# Altium project 452007098_MVEPP主传感器板.PrjPcb
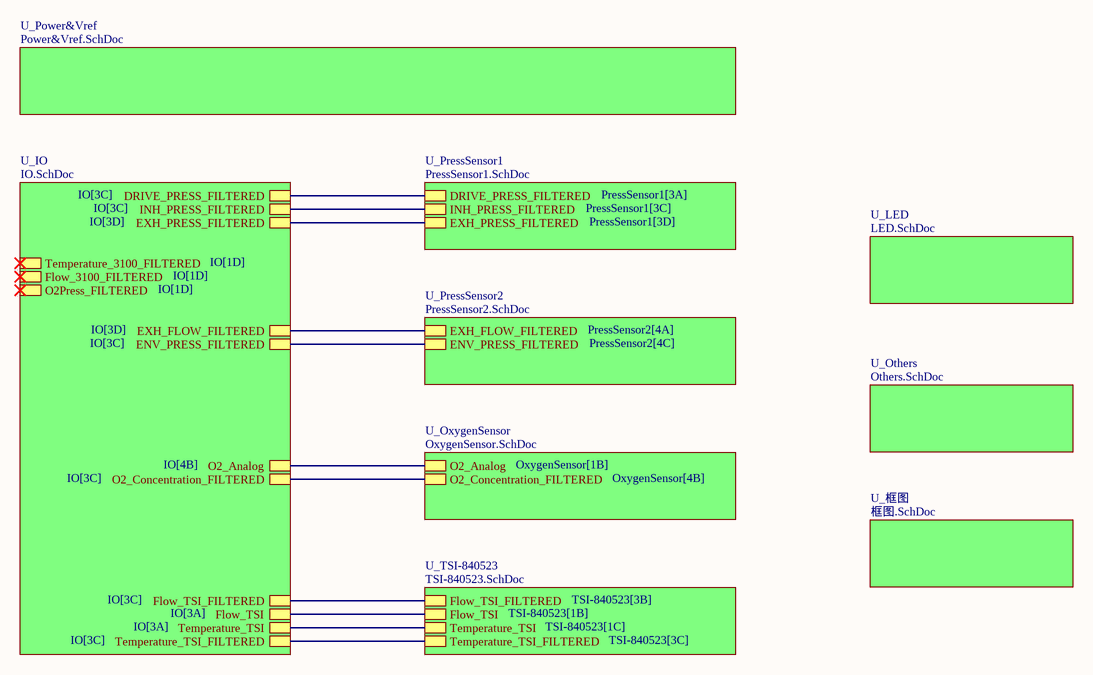
[diagram p0: Top.SchDoc]
10 sheets, 206 parts. Net scope: hierarchical (ports join the sheet entries above them; power ports are global).
Board file: PCB.PcbDoc
Sheets:
  Top.SchDoc
    U_OxygenSensor = OxygenSensor.SchDoc
    U_PressSensor1 = PressSensor1.SchDoc
    U_PressSensor2 = PressSensor2.SchDoc
    U_TSI-840523 = TSI-840523.SchDoc
    U_IO = IO.SchDoc
    U_Power&Vref = Power&Vref.SchDoc
    U_Others = Others.SchDoc
    U_框图 = 框图.SchDoc
    U_LED = LED.SchDoc

## Sheet Top.SchDoc
size A4; SheetNumber: 1; SheetTotal: 10

### Sub-sheets
U_IO = IO.SchDoc: O2_Concentration_FILTERED, Flow_TSI_FILTERED, Flow_TSI, Temperature_TSI, Temperature_TSI_FILTERED, DRIVE_PRESS_FILTERED, INH_PRESS_FILTERED, EXH_PRESS_FILTERED, EXH_FLOW_FILTERED, ENV_PRESS_FILTERED, O2_Analog, Temperature_3100_FILTERED, Flow_3100_FILTERED, O2Press_FILTERED
U_LED = LED.SchDoc: no entries
U_Others = Others.SchDoc: no entries
U_OxygenSensor = OxygenSensor.SchDoc: O2_Analog, O2_Concentration_FILTERED
U_Power&Vref = Power&Vref.SchDoc: no entries
U_PressSensor1 = PressSensor1.SchDoc: DRIVE_PRESS_FILTERED, INH_PRESS_FILTERED, EXH_PRESS_FILTERED
U_PressSensor2 = PressSensor2.SchDoc: EXH_FLOW_FILTERED, ENV_PRESS_FILTERED
U_TSI-840523 = TSI-840523.SchDoc: Flow_TSI_FILTERED, Flow_TSI, Temperature_TSI, Temperature_TSI_FILTERED
U_框图 = 框图.SchDoc: no entries

### Nets
DRIVE_PRESS_FILTERED: sheet U_PressSensor1/DRIVE_PRESS_FILTERED, sheet U_IO/DRIVE_PRESS_FILTERED
ENV_PRESS_FILTERED: sheet U_PressSensor2/ENV_PRESS_FILTERED, sheet U_IO/ENV_PRESS_FILTERED
EXH_FLOW_FILTERED: sheet U_PressSensor2/EXH_FLOW_FILTERED, sheet U_IO/EXH_FLOW_FILTERED
EXH_PRESS_FILTERED: sheet U_PressSensor1/EXH_PRESS_FILTERED, sheet U_IO/EXH_PRESS_FILTERED
Flow_TSI: sheet U_TSI-840523/Flow_TSI, sheet U_IO/Flow_TSI
Flow_TSI_FILTERED: sheet U_TSI-840523/Flow_TSI_FILTERED, sheet U_IO/Flow_TSI_FILTERED
INH_PRESS_FILTERED: sheet U_PressSensor1/INH_PRESS_FILTERED, sheet U_IO/INH_PRESS_FILTERED
O2_Analog: sheet U_OxygenSensor/O2_Analog, sheet U_IO/O2_Analog
O2_Concentration_FILTERED: sheet U_OxygenSensor/O2_Concentration_FILTERED, sheet U_IO/O2_Concentration_FILTERED
Temperature_TSI: sheet U_TSI-840523/Temperature_TSI, sheet U_IO/Temperature_TSI
Temperature_TSI_FILTERED: sheet U_TSI-840523/Temperature_TSI_FILTERED, sheet U_IO/Temperature_TSI_FILTERED

## Sheet OxygenSensor.SchDoc
size A4; SheetNumber: 5; SheetTotal: 10
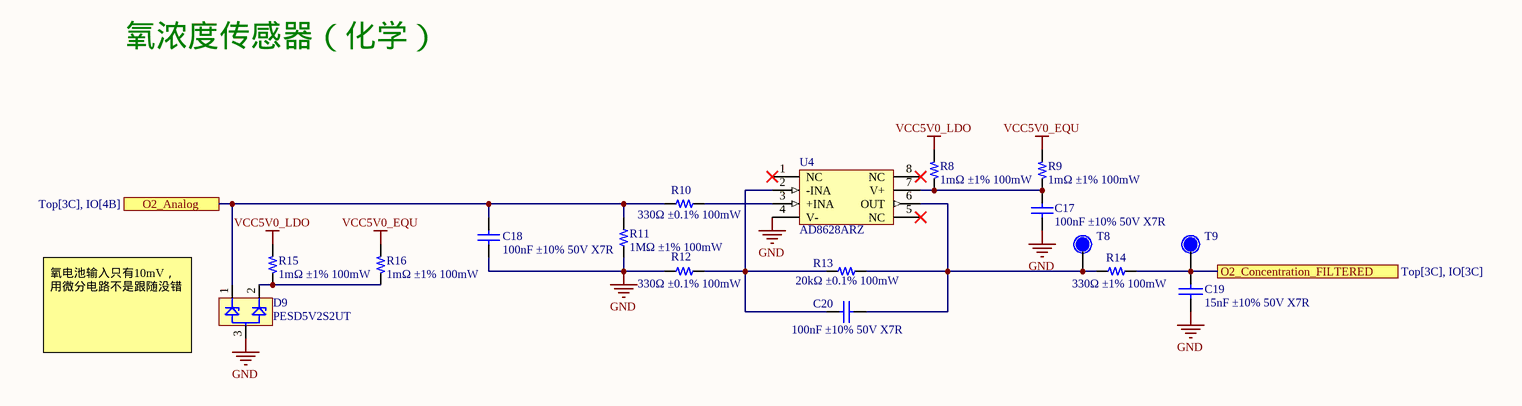
[diagram p1: OxygenSensor.SchDoc]

### Parts
C17  100nF ±10% 50V X7R  [C-0603]
C18  100nF ±10% 50V X7R  [C-0603]
C19  15nF ±10% 50V X7R  [C-0603]
C20  100nF ±10% 50V X7R  [C-0603]
D9  PESD5V2S2UT  [sot23-3]
R8  1mΩ ±1% 100mW  [R-0603]
R9  1mΩ ±1% 100mW  [R-0603]
R10  330Ω ±0.1% 100mW  [R-0603]
R11  1MΩ ±1% 100mW  [R-0603]
R12  330Ω ±0.1% 100mW  [R-0603]
R13  20kΩ ±0.1% 100mW  [R-0603]
R14  330Ω ±1% 100mW  [R-0603]
R15  1mΩ ±1% 100mW  [R-0603]
R16  1mΩ ±1% 100mW  [R-0603]
T8  Test?  [TestPad_SMD]  (value not drawn)
T9  Test?  [TestPad_SMD]  (value not drawn)
U4  AD8628ARZ  [SOIC8]

### Ports
O2_Analog (see Top[3C], IO[4B]), O2_Concentration_FILTERED (see Top[3C], IO[3C])

### Nets
GND: C17.2 C18.1 C19.1 D9.3 R11.2 R12.1(TOP) U4.4(V-)
VCC5V0_EQU: R9.2(BOT) R16.2(BOT)
VCC5V0_LDO: R8.2(BOT) R15.2(BOT)
O2_Analog: C18.2 D9.1 R10.1(TOP) R11.1 ; port O2_Analog
O2_Concentration_FILTERED: C19.2 R14.1 T9.1 ; port O2_Concentration_FILTERED
NetC17_1: C17.1 R8.1(TOP) R9.1(TOP) U4.7(V+)
NetC20_1: C20.1 R12.2(BOT) R13.1(TOP) U4.2(-INA)
NetC20_2: C20.2 R13.2(BOT) R14.2 T8.1 U4.6(OUT)
NetD9_2: D9.2 R15.1(TOP) R16.1(TOP)
NetR10_2: R10.2(BOT) U4.3(+INA)

Not connected (* = marked no-connect by the designer): U4 1(NC)* 5(NC)* 8(NC)*

### Notes on the sheet
- 氧浓度传感器（化学）
- (near D9) 氧电池输入只有10mV，用微分电路不是跟随没错

### Library data of the parts
C17 C18 C20 = 100nF_1: 物料编号: 210001894; 详细描述: X7R,50V,三星CL21B104JBCNNNC; 版本: V1.00; 名称: 贴片瓷介电容100nF±5%,0805; 制造商: 三星
C19 = CAP: Capacitor
D9 = PESDxS2UT
R8 R9 R15 R16 = 10K_1: 国巨 / 1mΩ ±1% 100mW; 版本: V1.00; 名称: 贴片电阻10K±1%; 物料编号: 210001830; 详细描述: 0805,1/8W,国巨RC0805FR-0710K; 制造商: 国巨
R10 R12 = 330Ω_1: 国巨RC0805FR-07330R; 物料编号: 210000706; 详细描述: 0805,1/8W,国巨RC0805FR-07330R; 制造商: 国巨; 版本: V1.00; 名称: 贴片电阻330±1%
R11 R14 = R-0603
R13 = 12K_1: 国巨RC0805FR-0712K; 物料编号: 210000764; 详细描述: 0805,1/8W,国巨RC0805FR-0712K; 制造商: 国巨; 版本: V1.00; 名称: 贴片电阻12K±1%
T8 T9 = TestPad_SMD
U4 = AD8628ARZ: 版本: V1.00; 名称: 芯片AD8628ARZ; 物料编号: 210001135; 详细描述: 精密运放AD8628ARZ ,SOIC8,-40℃+125℃; 制造商: ADI

## Sheet PressSensor1.SchDoc
size A4; SheetNumber: 7; SheetTotal: 10
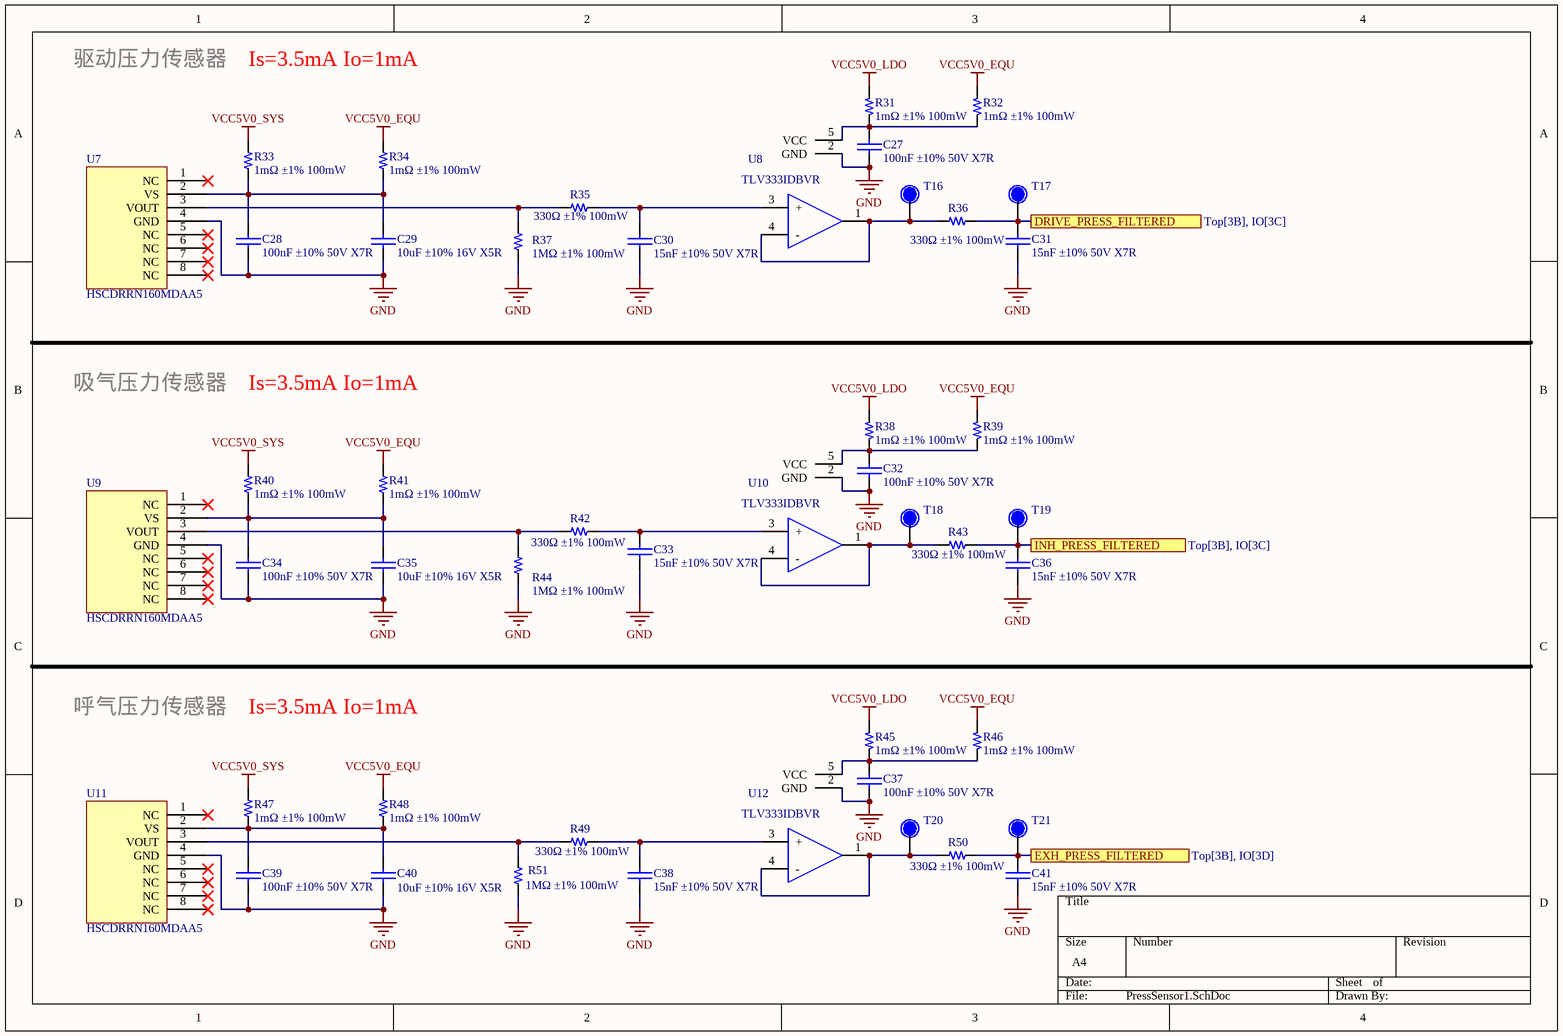
[diagram p2: PressSensor1.SchDoc]

### Parts
C27  100nF ±10% 50V X7R  [C-0603]
C28  100nF ±10% 50V X7R  [C-0603]
C29  10uF ±10% 16V X5R  [C-0805]
C30  15nF ±10% 50V X7R  [C-0603]
C31  15nF ±10% 50V X7R  [C-0603]
C32  100nF ±10% 50V X7R  [C-0603]
C33  15nF ±10% 50V X7R  [C-0603]
C34  100nF ±10% 50V X7R  [C-0603]
C35  10uF ±10% 16V X5R  [C-0805]
C36  15nF ±10% 50V X7R  [C-0603]
C37  100nF ±10% 50V X7R  [C-0603]
C38  15nF ±10% 50V X7R  [C-0603]
C39  100nF ±10% 50V X7R  [C-0603]
C40  10uF ±10% 16V X5R  [C-0805]
C41  15nF ±10% 50V X7R  [C-0603]
R31  1mΩ ±1% 100mW  [R-0603]
R32  1mΩ ±1% 100mW  [R-0603]
R33  1mΩ ±1% 100mW  [R-0603]
R34  1mΩ ±1% 100mW  [R-0603]
R35  330Ω ±1% 100mW  [R-0603]
R36  330Ω ±1% 100mW  [R-0603]
R37  1MΩ ±1% 100mW  [R-0603]
R38  1mΩ ±1% 100mW  [R-0603]
R39  1mΩ ±1% 100mW  [R-0603]
R40  1mΩ ±1% 100mW  [R-0603]
R41  1mΩ ±1% 100mW  [R-0603]
R42  330Ω ±1% 100mW  [R-0603]
R43  330Ω ±1% 100mW  [R-0603]
R44  1MΩ ±1% 100mW  [R-0603]
R45  1mΩ ±1% 100mW  [R-0603]
R46  1mΩ ±1% 100mW  [R-0603]
R47  1mΩ ±1% 100mW  [R-0603]
R48  1mΩ ±1% 100mW  [R-0603]
R49  330Ω ±1% 100mW  [R-0603]
R50  330Ω ±1% 100mW  [R-0603]
R51  1MΩ ±1% 100mW  [R-0603]
T16  Test?  [TestPad_SMD]  (value not drawn)
T17  Test?  [TestPad_SMD]  (value not drawn)
T18  Test?  [TestPad_SMD]  (value not drawn)
T19  Test?  [TestPad_SMD]  (value not drawn)
T20  Test?  [TestPad_SMD]  (value not drawn)
T21  Test?  [TestPad_SMD]  (value not drawn)
U7  HSCDRRN160MDAA5  [SSCDRR]
U8  TLV333IDBVR  [SOT23-5]
U9  HSCDRRN160MDAA5  [SSCDRR]
U10  TLV333IDBVR  [SOT23-5]
U11  HSCDRRN160MDAA5  [SSCDRR]
U12  TLV333IDBVR  [SOT23-5]

### Ports
DRIVE_PRESS_FILTERED (see Top[3B], IO[3C]), EXH_PRESS_FILTERED (see Top[3B], IO[3D]), INH_PRESS_FILTERED (see Top[3B], IO[3C])

### Nets
GND: C27.1 C28.1 C29.1 C30.1 C31.1 C32.1 C33.1 C34.1 C35.1 C36.1 C37.1 C38.1 C39.1 C40.1 C41.1 R37.2 R44.2 R51.2 U7.4(GND) U8.2(GND) U9.4(GND) U10.2(GND) U11.4(GND) U12.2(GND)
VCC5V0_EQU: R32.2(BOT) R34.1 R39.2(BOT) R41.1 R46.2(BOT) R48.1
VCC5V0_LDO: R31.2(BOT) R38.2(BOT) R45.2(BOT)
VCC5V0_SYS: R33.1 R40.1 R47.1
DRIVE_PRESS_FILTERED: C31.2 R36.1 T17.1 ; port DRIVE_PRESS_FILTERED
EXH_PRESS_FILTERED: C41.2 R50.1 T21.1 ; port EXH_PRESS_FILTERED
INH_PRESS_FILTERED: C36.2 R43.1 T19.1 ; port INH_PRESS_FILTERED
NetC27_2: C27.2 R31.1(TOP) R32.1(TOP) U8.5(VCC)
NetC28_2: C28.2 C29.2 R33.2 R34.2 U7.2(VS)
NetC30_2: C30.2 R35.1 U8.3(+)
NetC32_2: C32.2 R38.1(TOP) R39.1(TOP) U10.5(VCC)
NetC33_2: C33.2 R42.1 U10.3(+)
NetC34_2: C34.2 C35.2 R40.2 R41.2 U9.2(VS)
NetC37_2: C37.2 R45.1(TOP) R46.1(TOP) U12.5(VCC)
NetC38_2: C38.2 R49.1 U12.3(+)
NetC39_2: C39.2 C40.2 R47.2 R48.2 U11.2(VS)
NetR35_2: R35.2 R37.1 U7.3(VOUT)
NetR36_2: R36.2 T16.1 U8.1 U8.4(-)
NetR42_2: R42.2 R44.1 U9.3(VOUT)
NetR43_2: R43.2 T18.1 U10.1 U10.4(-)
NetR49_2: R49.2 R51.1 U11.3(VOUT)
NetR50_2: R50.2 T20.1 U12.1 U12.4(-)

Not connected (* = marked no-connect by the designer): U7 1(NC)* 5(NC)* 6(NC)* 7(NC)* 8(NC)*; U9 1(NC)* 5(NC)* 6(NC)* 7(NC)* 8(NC)*; U11 1(NC)* 5(NC)* 6(NC)* 7(NC)* 8(NC)*

### Notes on the sheet
- 驱动压力传感器
- Is=3.5mA Io=1mA
- 吸气压力传感器
- 呼气压力传感器

### Library data of the parts
C27 C28 C32 C34 C37 C39 = CAP
C29-C31 C33 C35 C36 C38 C40 C41 = CAP: Capacitor
R31 R32 R38 R39 R45 R46 = 10K_1: as R8 on sheet OxygenSensor; 制造商: 国巨
R33 R34 R40 R41 R47 R48 = R-0603: 国巨 / 1mΩ ±1% 100mW
R35-R37 R42-R44 R49-R51 = R-0603
T16-T21 = TestPad_SMD
U7 U9 U11 = SSCMJJ010KDAA5
U8 U10 U12 = TLV333IDBVR: 品牌：TI，型号：TLV333IDBVR,SOIC-8,–25°~+85°C,单运放，ROHS

## Sheet PressSensor2.SchDoc
size A4; SheetNumber: 8; SheetTotal: 10
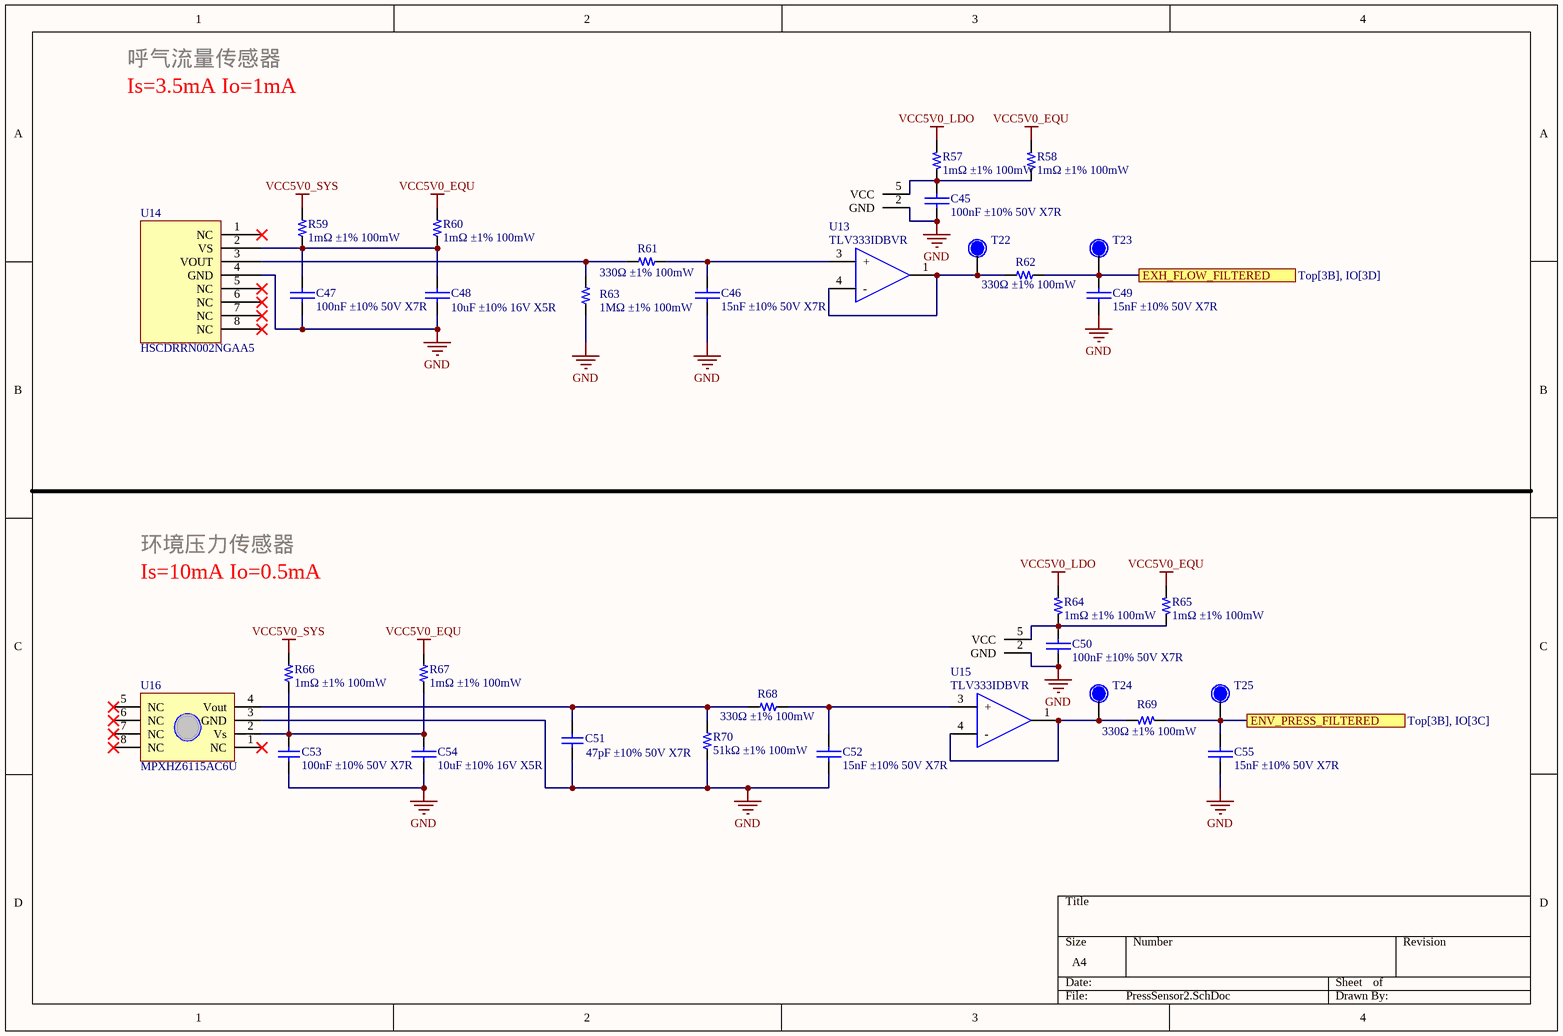
[diagram p3: PressSensor2.SchDoc]

### Parts
C45  100nF ±10% 50V X7R  [C-0603]
C46  15nF ±10% 50V X7R  [C-0603]
C47  100nF ±10% 50V X7R  [C-0603]
C48  10uF ±10% 16V X5R  [C-0805]
C49  15nF ±10% 50V X7R  [C-0603]
C50  100nF ±10% 50V X7R  [C-0603]
C51  47pF ±10% 50V X7R  [C-0603]
C52  15nF ±10% 50V X7R  [C-0603]
C53  100nF ±10% 50V X7R  [C-0603]
C54  10uF ±10% 16V X5R  [C-0805]
C55  15nF ±10% 50V X7R  [C-0603]
R57  1mΩ ±1% 100mW  [R-0603]
R58  1mΩ ±1% 100mW  [R-0603]
R59  1mΩ ±1% 100mW  [R-0603]
R60  1mΩ ±1% 100mW  [R-0603]
R61  330Ω ±1% 100mW  [R-0603]
R62  330Ω ±1% 100mW  [R-0603]
R63  1MΩ ±1% 100mW  [R-0603]
R64  1mΩ ±1% 100mW  [R-0603]
R65  1mΩ ±1% 100mW  [R-0603]
R66  1mΩ ±1% 100mW  [R-0603]
R67  1mΩ ±1% 100mW  [R-0603]
R68  330Ω ±1% 100mW  [R-0603]
R69  330Ω ±1% 100mW  [R-0603]
R70  51kΩ ±1% 100mW  [R-0603]
T22  Test?  [TestPad_SMD]  (value not drawn)
T23  Test?  [TestPad_SMD]  (value not drawn)
T24  Test?  [TestPad_SMD]  (value not drawn)
T25  Test?  [TestPad_SMD]  (value not drawn)
U13  TLV333IDBVR  [SOT23-5]
U14  HSCDRRN002NGAA5  [SSCDRR]
U15  TLV333IDBVR  [SOT23-5]
U16  MPXHZ6115AC6U  [1317]

### Ports
ENV_PRESS_FILTERED (see Top[3B], IO[3C]), EXH_FLOW_FILTERED (see Top[3B], IO[3D])

### Nets
GND: C45.1 C46.1 C47.1 C48.1 C49.1 C50.2 C51.1 C52.1 C53.2 C54.2 C55.1 R63.2 R70.1(TOP) U13.2(GND) U14.4(GND) U15.2(GND) U16.3(GND)
VCC5V0_EQU: R58.2(BOT) R60.1 R65.2(BOT) R67.1
VCC5V0_LDO: R57.2(BOT) R64.2(BOT)
VCC5V0_SYS: R59.1 R66.1
ENV_PRESS_FILTERED: C55.2 R69.1(TOP) T25.1 ; port ENV_PRESS_FILTERED
EXH_FLOW_FILTERED: C49.2 R62.1 T23.1 ; port EXH_FLOW_FILTERED
NetC45_2: C45.2 R57.1(TOP) R58.1(TOP) U13.5(VCC)
NetC46_2: C46.2 R61.1 U13.3(+)
NetC47_2: C47.2 C48.2 R59.2 R60.2 U14.2(VS)
NetC50_1: C50.1 R64.1(TOP) R65.1(TOP) U15.5(VCC)
NetC51_2: C51.2 R68.2 R70.2(BOT) U16.4(Vout)
NetC52_2: C52.2 R68.1 U15.3(+)
NetC53_1: C53.1 C54.1 R66.2 R67.2 U16.2(Vs)
NetR61_2: R61.2 R63.1 U14.3(VOUT)
NetR62_2: R62.2 T22.1 U13.1 U13.4(-)
NetR69_2: R69.2(BOT) T24.1 U15.1 U15.4(-)

Not connected (* = marked no-connect by the designer): U14 1(NC)* 5(NC)* 6(NC)* 7(NC)* 8(NC)*; U16 1(NC)* 5(NC)* 6(NC)* 7(NC)* 8(NC)*

### Notes on the sheet
- 呼气流量传感器
- Is=3.5mA Io=1mA
- 环境压力传感器
- Is=10mA Io=0.5mA

### Library data of the parts
C45 C47 C50 = CAP
C46 C48 C49 C52 C54 C55 = CAP: Capacitor
C51 = 100nF_1: 贴片瓷介电容100nF±5%,0805; 物料编号: 210001894; 详细描述: X7R,50V,三星CL21B104JBCNNNC; 版本: V1.00; 制造商: 三星; 名称: 贴片瓷介电容100nF±5%,0805
C53 = 100nF_1: as C17 on sheet OxygenSensor
R57 R58 R64 R65 = 10K_1: as R8 on sheet OxygenSensor; 制造商: 国巨
R59 R60 R66 R67 = R-0603: 国巨 / 1mΩ ±1% 100mW
R61-R63 R68 = R-0603
R69 = 100Ω_1: 国巨RC0805FR-07100R; 物料编号: 210000765; 详细描述: 0805,1/8W,国巨RC0805FR-07100R; 制造商: 国巨; 版本: V1.00; 名称: 贴片电阻100±1%
R70 = 10K_1: 国巨RC0805FR-0710K; 版本: V1.00; 名称: 贴片电阻10K±1%; 物料编号: 210001830; 详细描述: 0805,1/8W,国巨RC0805FR-0710K; 制造商: 国巨
T22-T25 = TestPad_SMD
U13 U15 = TLV333IDBVR: as U8 on sheet PressSensor1
U14 = SSCMJJ010KDAA5
U16 = MPXHZ6115AC6U: 名称: 芯片MPXHZ6115AC6U; 版本: V1.00; 物料编号: APPLY; 制造商: freescale; 详细描述: 贴片大气压传感器，1.5%最大误差。

## Sheet TSI-840523.SchDoc
size A4; SheetNumber: 6; SheetTotal: 10
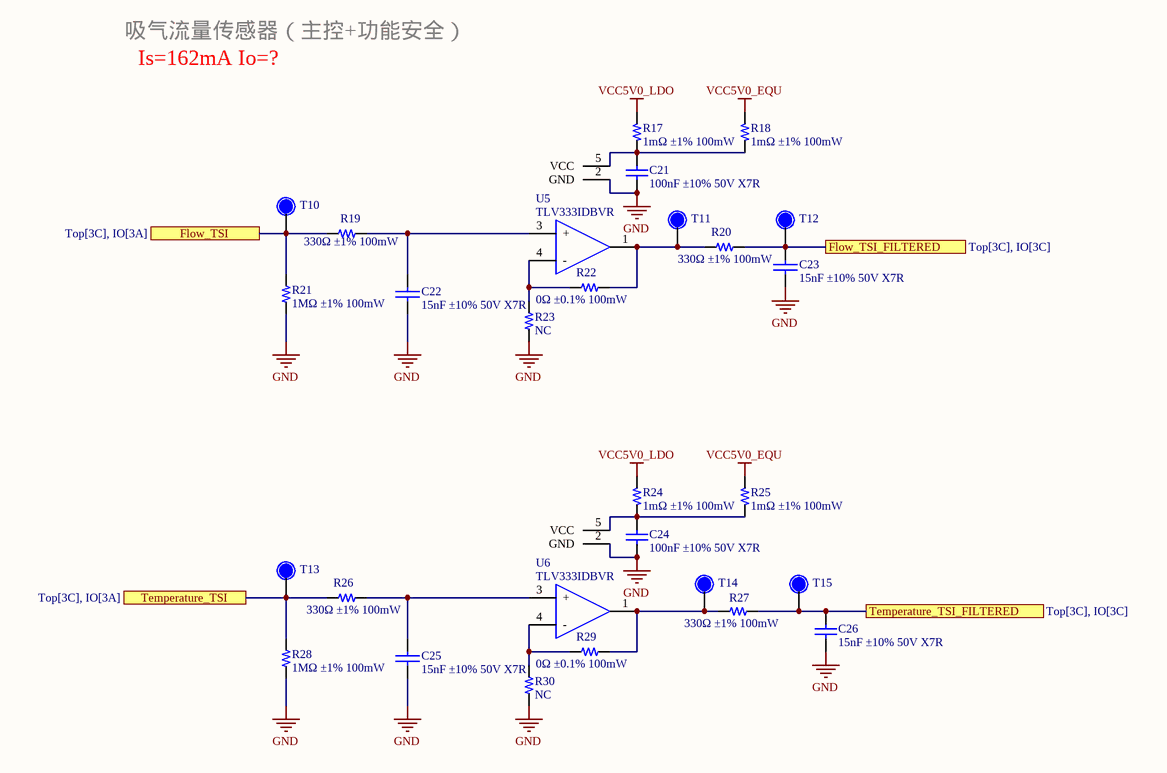
[diagram p4: TSI-840523.SchDoc]

### Parts
C21  100nF ±10% 50V X7R  [C-0603]
C22  15nF ±10% 50V X7R  [C-0603]
C23  15nF ±10% 50V X7R  [C-0603]
C24  100nF ±10% 50V X7R  [C-0603]
C25  15nF ±10% 50V X7R  [C-0603]
C26  15nF ±10% 50V X7R  [C-0603]
R17  1mΩ ±1% 100mW  [R-0603]
R18  1mΩ ±1% 100mW  [R-0603]
R19  330Ω ±1% 100mW  [R-0603]
R20  330Ω ±1% 100mW  [R-0603]
R21  1MΩ ±1% 100mW  [R-0603]
R22  0Ω ±0.1% 100mW  [R-0603]
R23  NC  [R-0603]
R24  1mΩ ±1% 100mW  [R-0603]
R25  1mΩ ±1% 100mW  [R-0603]
R26  330Ω ±1% 100mW  [R-0603]
R27  330Ω ±1% 100mW  [R-0603]
R28  1MΩ ±1% 100mW  [R-0603]
R29  0Ω ±0.1% 100mW  [R-0603]
R30  NC  [R-0603]
T10  Test?  [TestPad_SMD]  (value not drawn)
T11  Test?  [TestPad_SMD]  (value not drawn)
T12  Test?  [TestPad_SMD]  (value not drawn)
T13  Test?  [TestPad_SMD]  (value not drawn)
T14  Test?  [TestPad_SMD]  (value not drawn)
T15  Test?  [TestPad_SMD]  (value not drawn)
U5  TLV333IDBVR  [SOT23-5]
U6  TLV333IDBVR  [SOT23-5]

### Ports
Flow_TSI (see Top[3C], IO[3A]), Flow_TSI_FILTERED (see Top[3C], IO[3C]), Temperature_TSI (see Top[3C], IO[3A]), Temperature_TSI_FILTERED (see Top[3C], IO[3C])

### Nets
GND: C21.1 C22.2 C23.2 C24.1 C25.2 C26.1 R21.2 R23.1(TOP) R28.2 R30.1(TOP) U5.2(GND) U6.2(GND)
VCC5V0_EQU: R18.2(BOT) R25.2(BOT)
VCC5V0_LDO: R17.2(BOT) R24.2(BOT)
Flow_TSI: R19.1(TOP) R21.1 T10.1 ; port Flow_TSI
Flow_TSI_FILTERED: C23.1 R20.2(BOT) T12.1 ; port Flow_TSI_FILTERED
Temperature_TSI: R26.1(TOP) R28.1 T13.1 ; port Temperature_TSI
Temperature_TSI_FILTERED: C26.2 R27.1(TOP) T15.1 ; port Temperature_TSI_FILTERED
NetC21_2: C21.2 R17.1(TOP) R18.1(TOP) U5.5(VCC)
NetC22_1: C22.1 R19.2(BOT) U5.3(+)
NetC24_2: C24.2 R24.1(TOP) R25.1(TOP) U6.5(VCC)
NetC25_1: C25.1 R26.2(BOT) U6.3(+)
NetR20_1: R20.1(TOP) R22.2(BOT) T11.1 U5.1
NetR22_1: R22.1(TOP) R23.2(BOT) U5.4(-)
NetR27_2: R27.2(BOT) R29.2(BOT) T14.1 U6.1
NetR29_1: R29.1(TOP) R30.2(BOT) U6.4(-)

### Notes on the sheet
- 吸气流量传感器（主控+功能安全）
- Is=162mA Io=?

### Library data of the parts
C21 C24 = 100nF_1: as C17 on sheet OxygenSensor
C22 C23 C25 = CAP: Capacitor
C26 = C-0603: 物料编号: *; 物料名称: *; 厂家: *; 详细描述: *
R17 R18 R24 R25 = 10K_1: as R8 on sheet OxygenSensor; 制造商: 国巨
R19 R20 R26 = 100R-0603: 国巨RC0603FR-07100RL,0603,1/10W; 详细描述: 国巨RC0603FR-07100RL,0603,1/10W,; 制造商: 国巨; 版本: V1.00; 名称: 贴片电阻100R±1%
R21 R28 = R-0603
R22 R23 R29 R30 = 1K_1: 国巨RC0805FR-071K; 物料编号: 210001832; 详细描述: 0805,1/8W,国巨RC0805FR-071K; 制造商: 国巨; 版本: V1.00; 名称: 贴片电阻1K±1%
R27 = 100Ω_1: as R69 on sheet PressSensor2
T10-T15 = TestPad_SMD
U5 U6 = TLV333IDBVR: as U8 on sheet PressSensor1

## Sheet IO.SchDoc
size A4; SheetNumber: 2; SheetTotal: 10
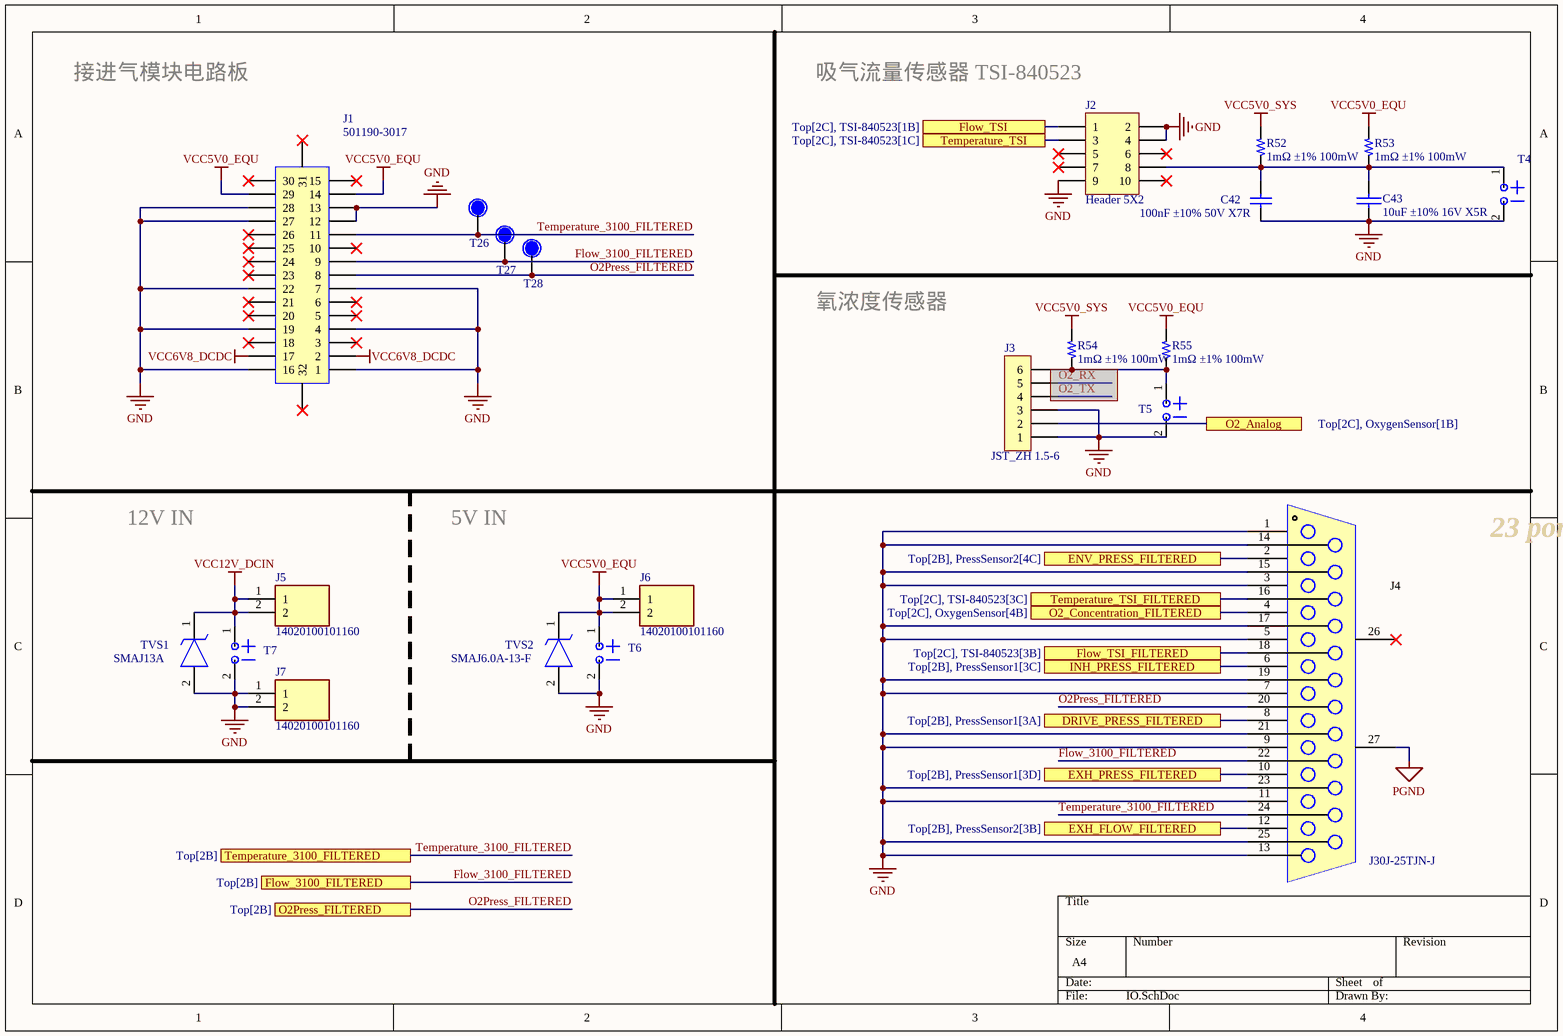
[diagram p5: IO.SchDoc]

### Parts
C42  100nF ±10% 50V X7R  [C-0603]
C43  10uF ±10% 16V X5R  [C-0805]
J1  501190-3017  [501190-3017]
J2  Header 5X2  [878311041]
J3  JST_ZH 1.5-6  [JST_ZH 1.5-6]
J4  J30J-25TJN-J  [J30J-25TJN-J]
J5  14020100101160  [14020100101160]
J6  14020100101160  [14020100101160]
J7  14020100101160  [14020100101160]
R52  1mΩ ±1% 100mW  [R-0603]
R53  1mΩ ±1% 100mW  [R-0603]
R54  1mΩ ±1% 100mW  [R-0603]
R55  1mΩ ±1% 100mW  [R-0603]
T4  POWER_TEST  [BT]  (value not drawn)  (no BOM)
T5  POWER_TEST  [BT]  (value not drawn)  (no BOM)
T6  POWER_TEST  [BT]  (value not drawn)  (no BOM)
T7  POWER_TEST  [BT]  (value not drawn)  (no BOM)
T26  Test?  [TestPad_SMD]  (value not drawn)
T27  Test?  [TestPad_SMD]  (value not drawn)
T28  Test?  [TestPad_SMD]  (value not drawn)
TVS1  SMAJ13A  [DIONM5126X250N]
TVS2  SMAJ6.0A-13-F  [DIOM5226X240N]

### Ports
DRIVE_PRESS_FILTERED (see Top[2B], PressSensor1[3A]), ENV_PRESS_FILTERED (see Top[2B], PressSensor2[4C]), EXH_FLOW_FILTERED (see Top[2B], PressSensor2[3B]), EXH_PRESS_FILTERED (see Top[2B], PressSensor1[3D]), Flow_3100_FILTERED (see Top[2B]), Flow_TSI (see Top[2C], TSI-840523[1B]), Flow_TSI_FILTERED (see Top[2C], TSI-840523[3B]), INH_PRESS_FILTERED (see Top[2B], PressSensor1[3C]), O2_Analog (see Top[2C], OxygenSensor[1B]), O2_Concentration_FILTERED (see Top[2C], OxygenSensor[4B]), O2Press_FILTERED (see Top[2B]), Temperature_3100_FILTERED (see Top[2B]), Temperature_TSI (see Top[2C], TSI-840523[1C]), Temperature_TSI_FILTERED (see Top[2C], TSI-840523[3C])

### Nets
GND: C42.1 C43.1 J1.1 J1.4 J1.7 J1.12 J1.13 J1.16 J1.19 J1.22 J1.27 J1.28 J2.2 J2.4 J2.9 J3.1 J3.3 J4.1 J4.3 J4.5 J4.7 J4.9 J4.11 J4.13 J4.14 J4.15 J4.17 J4.19 J4.21 J4.23 J4.25 J7.1 J7.2 T4.2(-) T5.2(-) T6.2(-) T7.2(-) TVS1.2(A) TVS2.2(A)
PGND: J4.27
VCC5V0_EQU: J1.14 J1.29 J6.1 J6.2 R53.2(BOT) R55.2(BOT) T6.1(+) TVS2.1(K)
VCC5V0_SYS: R52.2(BOT) R54.2(BOT)
VCC6V8_DCDC: J1.2 J1.17
VCC12V_DCIN: J5.1 J5.2 T7.1(+) TVS1.1(K)
DRIVE_PRESS_FILTERED: J4.8 ; port DRIVE_PRESS_FILTERED
ENV_PRESS_FILTERED: J4.2 ; port ENV_PRESS_FILTERED
EXH_FLOW_FILTERED: J4.12 ; port EXH_FLOW_FILTERED
EXH_PRESS_FILTERED: J4.10 ; port EXH_PRESS_FILTERED
Flow_3100_FILTERED: J1.9 J4.22 T27.1 ; port Flow_3100_FILTERED
Flow_TSI: J2.1 ; port Flow_TSI
Flow_TSI_FILTERED: J4.18 ; port Flow_TSI_FILTERED
INH_PRESS_FILTERED: J4.6 ; port INH_PRESS_FILTERED
O2_Analog: J3.2 ; port O2_Analog
O2_Concentration_FILTERED: J4.4 ; port O2_Concentration_FILTERED
O2Press_FILTERED: J1.8 J4.20 T28.1 ; port O2Press_FILTERED
Temperature_3100_FILTERED: J1.11 J4.24 T26.1 ; port Temperature_3100_FILTERED
Temperature_TSI: J2.3 ; port Temperature_TSI
Temperature_TSI_FILTERED: J4.16 ; port Temperature_TSI_FILTERED
NetC42_2: C42.2 C43.2 J2.8 R52.1(TOP) R53.1(TOP) T4.1(+)
NetJ3_6: J3.6 R54.1(TOP) R55.1(TOP) T5.1(+)

Not connected (* = marked no-connect by the designer): J1 3* 5* 6* 10* 15* 18* 20* 21* 23* 24* 25* 26* 30* 31* 32*; J2 5* 6* 7* 10*; J3 4 5; J4 26*

### Notes on the sheet
- 接进气模块电路板
- 吸气流量传感器 TSI-840523
- 氧浓度传感器
- 12V IN
- 5V IN
- (near J4) 23 ports

### Library data of the parts
C42 = 100nF_1: as C17 on sheet OxygenSensor
C43 = CAP: Capacitor
J2 = Header 5X2: Header, 5-Pin, Dual row; LatestRevisionDate: 17-Jul-2002; LatestRevisionNote: Re-released for DXP Platform.; Publisher: Altium Limited
J3 = JST_ZH 1.5-6: 品牌：JST 型号：B6B-ZR，直插，间距1.5，6pin; 名称: 插座2针，2.0间距; 制造商: JST
J4 = J30J-25TJN-J: Manufacturer: BOOMELE(博穆精密); Name: GH1.25-5PLTPZ; Add into BOM: yes; Symbol: GH1.25-5PLTPZ; Device: GH1.25-5PLTPZ; LCSC Part Name: GH1.25-5P立贴编带加盖; Supplier Part: C2829263; Manufacturer Part: GH1.25-5PLTPZ; Supplier Footprint: -; JLCPCB Part Class: Extended Part; Datasheet: https://atta.szlcsc.com/upload/public/pdf/source/20211125/08A09A4909F58AF780B71FE423A00F7E.pdf; Supplier: LCSC; Convert to PCB: yes
J5-J7 = 14020100101160: Connector; Manufacturer_Name: HARTING; Datasheet Link: https://g.componentsearchengine.com/Datasheets/0/17149084.pdf; Height: 6.65mm; Manufacturer_Part_Number: 14020100101160
R52-R55 = 10K_1: as R8 on sheet OxygenSensor; 制造商: 国巨
T26-T28 = TestPad_SMD
TVS1 = SMAJ13A: TVS Diode (Uni-directional); Manufacturer_Name: LITTELFUSE; Datasheet Link: https://componentsearchengine.com/Datasheets/2/SMAJ13A.pdf; Height: 2.5mm; Manufacturer_Part_Number: SMAJ13A; Mouser Part Number: 576-SMAJ13A; Mouser Price/Stock: https://www.mouser.co.uk/ProductDetail/Littelfuse/SMAJ13A?qs=HR2RnyOI4E60xAs7pDj%2F%252BA%3D%3D; Arrow Part Number: SMAJ13A; Arrow Price/Stock: https://www.arrow.com/en/products/smaj13a/littelfuse
TVS2 = SMAJ6.0A-13-F: TVS Diode (Uni-directional); Manufacturer_Name: Diodes Incorporated; Datasheet Link: https://www.arrow.com/en/products/smaj6.0a-13-f/diodes-incorporated; Height: 2.4mm; Manufacturer_Part_Number: SMAJ6.0A-13-F; Mouser Part Number: 621-SMAJ6.0A-13-F; Mouser Price/Stock: https://www.mouser.co.uk/ProductDetail/Diodes-Incorporated/SMAJ60A-13-F?qs=gaDBXWSqsDBS%252B5NeClx%252BYA%3D%3D; Arrow Part Number: SMAJ6.0A-13-F; Arrow Price/Stock: https://www.arrow.com/en/products/smaj6.0a-13-f/diodes-incorporated?region=nac

## Sheet Power&Vref.SchDoc
size A4; SheetNumber: 3; SheetTotal: 10; SPICEModelCacheUSJFIODM: <root> / <DocumentId>USJFIODM</DocumentId> / <CacheFrame Number="0"> / <Model Name="1050_7443251600_16u" Kind="CKT"> / <Text>******* / .subckt 1050_7443251600_16u 1 2 / Rp 1 2 4256 / Cp 1 2 5.33p / Rs 1 N3 0.0345 / L1 N3 2 16u / .ends 1050_7443251600_16u</Text> / </Model> / </CacheFrame> / </root>
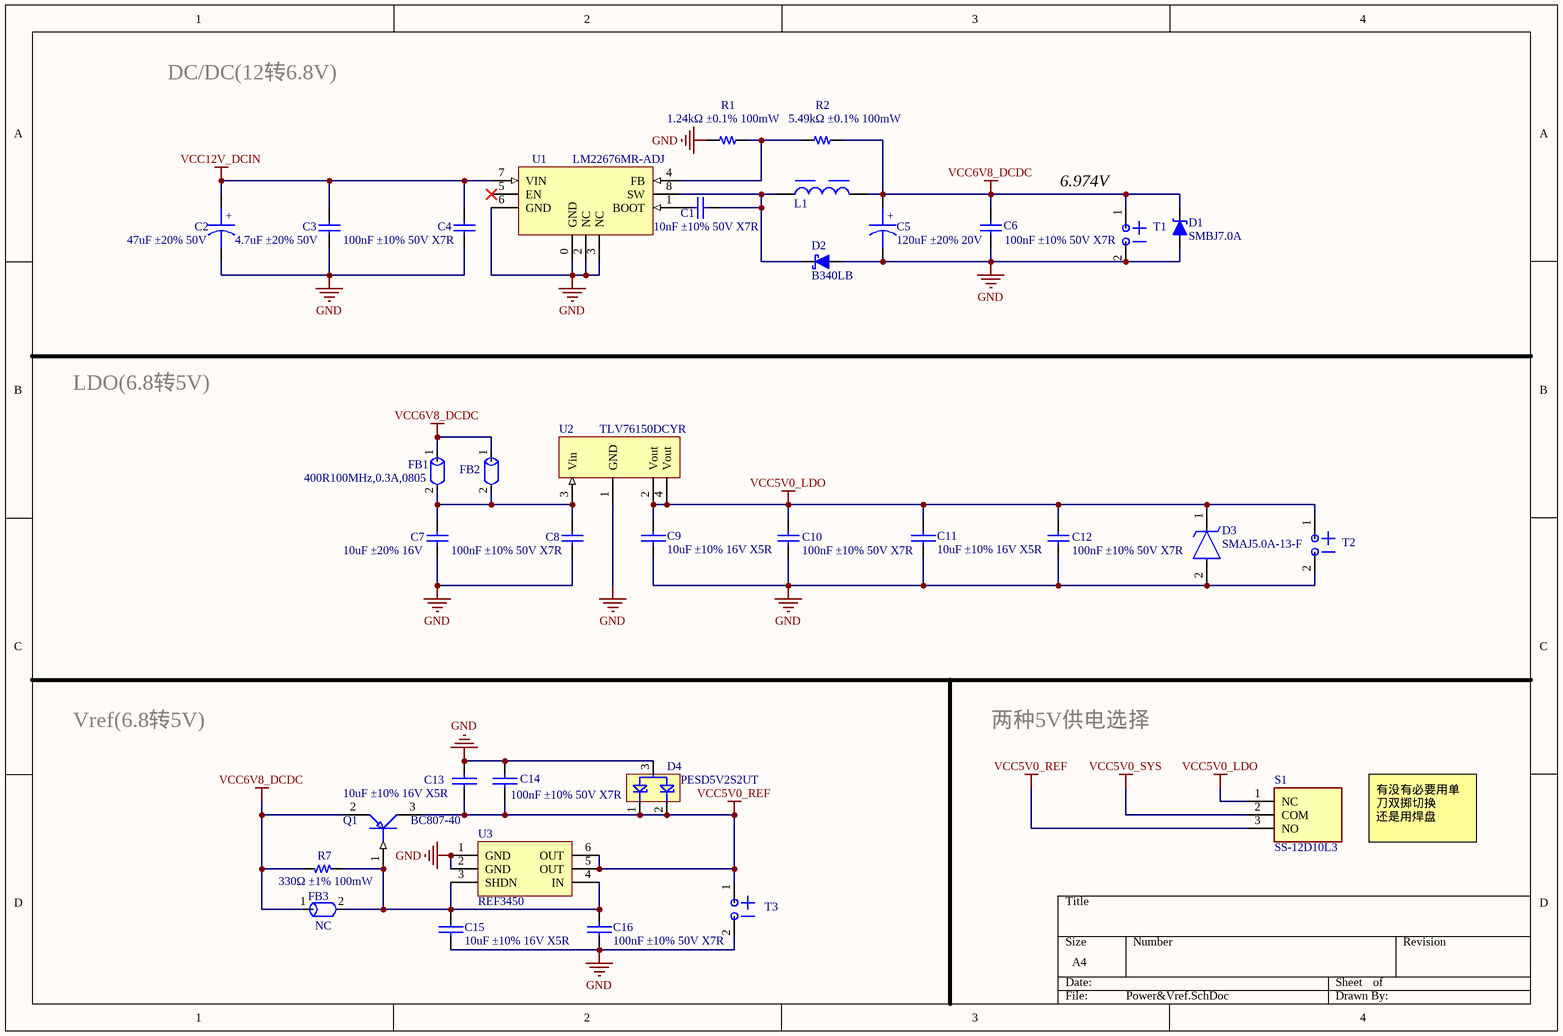
[diagram p6: Power&Vref.SchDoc]

### Parts
C1  10nF ±10% 50V X7R  [C-0603]
C2  47uF ±20% 50V  [CAP-SMD-φ6.3]
C3  4.7uF ±20% 50V  [C-0805]
C4  100nF ±10% 50V X7R  [C-0603]
C5  120uF ±20% 20V  [CAP-SMD-φ6.3]
C6  100nF ±10% 50V X7R  [C-0603]
C7  10uF ±20% 16V  [C-0805]
C8  100nF ±10% 50V X7R  [C-0603]
C9  10uF ±10% 16V X5R  [C-0805]
C10  100nF ±10% 50V X7R  [C-0603]
C11  10uF ±10% 16V X5R  [C-0805]
C12  100nF ±10% 50V X7R  [C-0603]
C13  10uF ±10% 16V X5R  [C-0805]
C14  100nF ±10% 50V X7R  [C-0603]
C15  10uF ±10% 16V X5R  [C-0805]
C16  100nF ±10% 50V X7R  [C-0603]
D1  SMBJ7.0A  [DO-214AA/SMB]
D2  B340LB  [DO-214AA/SMB]
D3  SMAJ5.0A-13-F  [DIOM5226X230N]
D4  PESD5V2S2UT  [sot23-3]
FB1  400R100MHz,0.3A,0805  [R-0805]
FB2  400R100MHz,0.3A,0805  [R-0805]  (value not drawn)
FB3  NC  [R-0805]
L1  16µH, 6.25A  [WE-HCI_1050]  (value not drawn)
Q1  BC807-40  [SOT23-3]
R1  1.24kΩ ±0.1% 100mW  [R-0603]
R2  5.49kΩ ±0.1% 100mW  [R-0603]
R7  330Ω ±1% 100mW  [R-0805]
S1  SS-12D10L3  [SS12D10L3]
T1  POWER_TEST  [BT]  (value not drawn)  (no BOM)
T2  POWER_TEST  [BT]  (value not drawn)  (no BOM)
T3  POWER_TEST  [BT]  (value not drawn)  (no BOM)
U1  LM22676MR-ADJ  [SOIC-8(4.90*3.9)-EPAD]
U2  TLV76150DCYR  [SOT223]
U3  REF3450  [SOT23-6]

### Nets
GND: C2.2 C3.1 C4.1 C5.2 C6.1 C7.1 C8.1 C9.1 C10.1 C11.1 C12.1 C13.1 C14.2 C15.1 C16.1 D1.A D2.A D3.2(A) D4.3 R1.1(TOP) T1.2(-) T2.2(-) T3.2(-) U1.0(GND) U1.2(NC) U1.3(NC) U1.6(GND) U2.1(GND) U3.1(GND) U3.2(GND)
VCC5V0_LDO: C9.2 C10.2 C11.2 C12.2 D3.1(K) S1.1(NC) T2.1(+) U2.2(Vout) U2.4(Vout)
VCC5V0_REF: C13.2 C14.1 D4.1 D4.2 Q1.3(C) S1.3(NO) T3.1(+) U3.5(OUT) U3.6(OUT)
VCC5V0_SYS: S1.2(COM)
VCC6V8_DCDC: C5.1 C6.2 D1.K FB1.1 FB2.1 FB3.1 L1.2 Q1.2(E) R2.1(TOP) R7.2(BOT) T1.1(+)
VCC12V_DCIN: C2.1 C3.2 C4.2 U1.7(VIN)
NetC1_1: C1.1 D2.K L1.1 U1.8(SW)
NetC1_2: C1.2 U1.1(BOOT)
NetC7_2: C7.2 C8.2 FB1.2 FB2.2 U2.3(Vin)
NetC15_2: C15.2 C16.2 FB3.2 Q1.1(B) R7.1(TOP) U3.3(SHDN) U3.4(IN)
NetR1_2: R1.2(BOT) R2.2(BOT) U1.4(FB)

Not connected (* = marked no-connect by the designer): U1 5(EN)*

### Notes on the sheet
- DC/DC(12转6.8V)
- (near T1) 6.974V
- LDO(6.8转5V)
- Vref(6.8转5V)
- 两种5V供电选择
- 有没有必要用单刀双掷切换
  还是用焊盘
- (in symbol 10uF/16V贴片铝电解) +
- (in symbol 100uF/25V贴片铝电解) +

### Library data of the parts
C1 = 10nF_1: 贴片瓷介电容10nF±10%,0805; 物料编号: 210001895; 详细描述: X7R,50V,三星CL21B103KBANNNC; 版本: V1.00; 名称: 贴片瓷介电容10nF±10%,0805; 制造商: *
C2 = 10uF/16V贴片铝电解: EEEFT1H470AP; 版本: V1.00; 名称: 贴片铝电解电容10uF/16V; 物料编号: APLLY; 详细描述: 4.0mm X 5.3mm 体积，贴片铝电解电容10uF/16V; 制造商: TBD
C3 C7 = C-1210
C4 C6 C8 C10 C12 = 100nF_1: as C17 on sheet OxygenSensor
C5 = 100uF/25V贴片铝电解: 名称: 贴片铝电解电容100uF/25V; 版本: V1.00; 详细描述: 6.3mm X 7.7mm体积，贴片铝电解电容100uF/25V; 制造商: TBD; 物料编号: APPLY
C9 C11 C13 C15 = CAP: Capacitor
C14 C16 = CAP
D1 = Diode-稳压-213AB/LL34/MiniMELF: 厂家: *; 物料名称: *; 物料编号: *; 详细描述: *
D2 = Diode-肖特基-214AA  (SMB): 版本: V1.00; 物料编号: APLLY; 详细描述: 贴片，二极管
D3 = SMAJ5.0A-13-F: TVS Diode (Uni-directional); Manufacturer_Name: Diodes Incorporated; Datasheet Link: https://componentsearchengine.com/Datasheets/2/SMAJ5.0A-13-F.pdf; Height: 2.3mm; Manufacturer_Part_Number: SMAJ5.0A-13-F; Mouser Part Number: 621-SMAJ5.0A-13-F; Mouser Price/Stock: https://www.mouser.co.uk/ProductDetail/Diodes-Incorporated/SMAJ5.0A-13-F?qs=gaDBXWSqsDCr%2F5d1gQdliw%3D%3D; Arrow Part Number: SMAJ5.0A-13-F; Arrow Price/Stock: https://www.arrow.com/en/products/smaj5.0a-13-f/diodes-incorporated?region=europe
D4 = PESDxS2UT
FB1-FB3 = FB_1K/500mA_0805: Rdc0.3Ω,伍尔特,742792032; 名称: 贴片磁珠1K/500mA，0805; 版本: V1.00; 物料编号: 210001925; 详细描述: Rdc0.3,R材料,TDK MMZ2012R102A; 制造商: TDK
L1 = 7443251600: WE-HCI SMT Flat Wire High Current Inductor, size 1050, 16µH, 6.25A, 34.5mΩ; Manufacturer: Wurth Elektronik; Case/Size Code: 1050; Material: Superflux; Saturation Current: 6.5A; Self Resonant Frequency: 18MHz; Manufacturer Part Number: 7443251600; Category: Shielded Power Inductors; Match Code: WE-HCI; ComponentLink1Description: Website Link; ComponentLink1URL: https://www.we-online.com/redexpert/article/7443251600?ad; ComponentLink2Description: Datasheet Link; ComponentLink2URL: https://www.we-online.com/redexpert/spec/7443251600?ad; Mount: Surface Mount; Operating Temperature Max: 150°C; Operating Temperature Min: -40°C; Packaging: Tape and Reel; Length: 10.2mm; Width: 10.2mm; Height: 4.7mm; DC Resistance: 34.5mΩ; Inductance: 16µH; Performance Rated Current: 6.25A
Q1 = BC807-40: 版本: V1.00; 物料编号: *; 详细描述: *
R1 = 3.3K_1: 国巨RC0805FR-073K3; 物料编号: 210001835; 详细描述: 0805,1/8W,国巨RC0805FR-073K3; 制造商: 国巨; 版本: V1.00; 名称: 贴片电阻3.3K±1%
R2 = 10K_1: RT0603BRD075K49L; 版本: V1.00; 名称: 贴片电阻10K±1%; 物料编号: 210001830; 详细描述: 0805,1/8W,国巨RC0805FR-0710K; 制造商: 国巨
R7 = 100Ω_1: as R69 on sheet PressSensor2
S1 = SS-12D10L3: Switch; Manufacturer_Name: XKB Connectivity; Datasheet Link: http://www.helloxkb.com/public/images/pdf/SS-12D10XXX.pdf; Height: 9.6mm; Manufacturer_Part_Number: SS-12D10L3
U1 = LM22676MR-ADJ: 版本: V1.00; 名称: 芯片LM22676MR-ADJ; 详细描述: N沟道MOS管，输出电压可调，电流3A，; 制造商: NS; 物料编号: APPLY
U2 = LM1117IMP-3.3/NOPB: 品牌：TI，型号：LM1117IMP-3.3/NOPB，800-mA Low-Dropout，SOT223，-40~+ 125°C，ROHS
U3 = REF3225

## Sheet Others.SchDoc
size A4; SheetNumber: 9; SheetTotal: 10
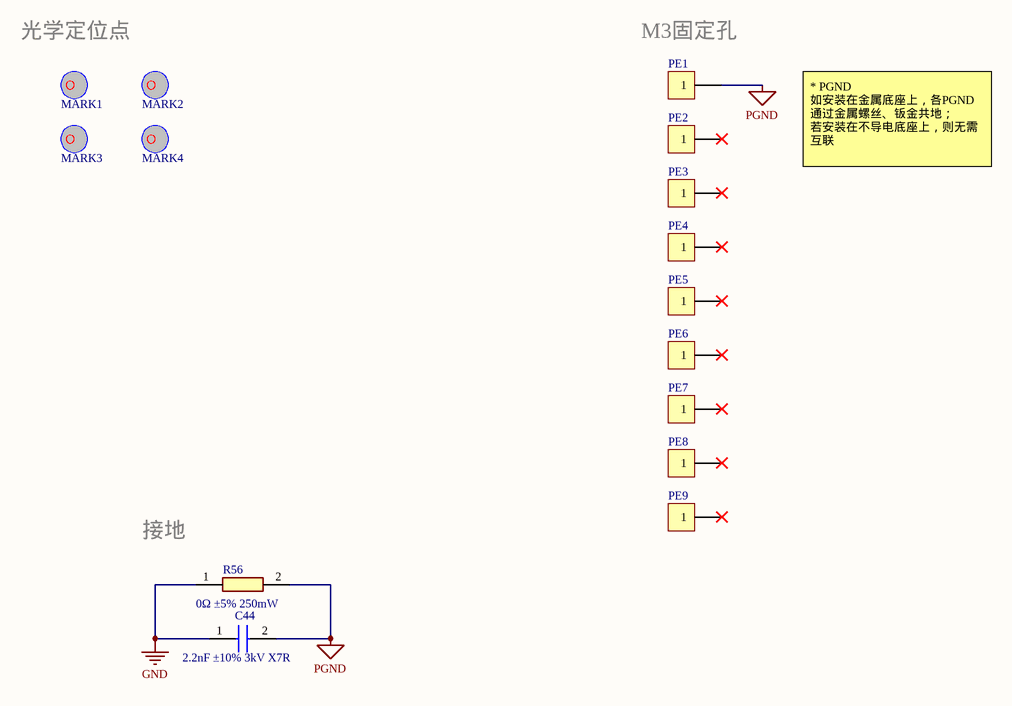
[diagram p7: Others.SchDoc]

### Parts
C44  2.2nF ±10% 3kV X7R  [CAPC4532X320N]
MARK1  MARK_POINT  [MARK_POINT]  (value not drawn)  (no BOM)
MARK2  MARK_POINT  [MARK_POINT]  (value not drawn)  (no BOM)
MARK3  MARK_POINT  [MARK_POINT]  (value not drawn)  (no BOM)
MARK4  MARK_POINT  [MARK_POINT]  (value not drawn)  (no BOM)
PE1  (no value)  [固定孔-M3]  (no BOM)
PE2  (no value)  [固定孔-M3]  (no BOM)
PE3  (no value)  [固定孔-M3]  (no BOM)
PE4  (no value)  [固定孔-M3]  (no BOM)
PE5  (no value)  [固定孔-M3]  (no BOM)
PE6  (no value)  [固定孔-M3]  (no BOM)
PE7  (no value)  [固定孔-M3]  (no BOM)
PE8  (no value)  [固定孔-M3]  (no BOM)
PE9  (no value)  [固定孔-M3]  (no BOM)
R56  0Ω ±5% 250mW  [RESC3116X65N]

### Nets
GND: C44.1 R56.1
PGND: C44.2 PE1.1 R56.2

Not connected (* = marked no-connect by the designer): PE2 1*; PE3 1*; PE4 1*; PE5 1*; PE6 1*; PE7 1*; PE8 1*; PE9 1*

### Notes on the sheet
- (near MARK1) 光学定位点
- (near PE1) M3固定孔
- * PGND
  如安装在金属底座上，各PGND通过金属螺丝、钣金共地；
  若安装在不导电底座上，则无需互联
- 接地

### Library data of the parts
C44 = HV1812Y222KXHATHV: HV1812Y222KXHATHV / 2.2nF / 精度: ±10% / 额定电压: 3kV / 材质(温度系数): X7R / 1812; Manufacturer_Name: Vishay; Datasheet Link: https://www.vishay.com/docs/45228/hvseries.pdf; Height: 3.2mm; Manufacturer_Part_Number: HV1812Y222KXHATHV; Mouser Part Number: 77-HV1812Y222KXHATHV; Mouser Price/Stock: https://www.mouser.co.uk/ProductDetail/Vishay-Vitramon/HV1812Y222KXHATHV?qs=%252BaFUgn%2FzHmzQEhPV2A6xhg%3D%3D; Arrow Part Number: HV1812Y222KXHATHV; Arrow Price/Stock: https://www.arrow.com/en/products/hv1812y222kxhathv/vishay
PE1-PE9 = CON1: Connector
R56 = RC1206JR-070RL: Manufacturer_Name: YAGEO; Datasheet Link: https://www.yageo.com/upload/media/product/productsearch/datasheet/rchip/PYu-RC_Group_51_RoHS_L_12.pdf; Height: 0.65mm; Manufacturer_Part_Number: RC1206JR-070RL; Mouser Part Number: 603-RC1206JR-070RL; Mouser Price/Stock: https://www.mouser.co.uk/ProductDetail/YAGEO/RC1206JR-070RL?qs=stZGH%252BcYwe4ZstaKNiOb8Q%3D%3D; Arrow Part Number: RC1206JR-070RL; Arrow Price/Stock: https://www.arrow.com/en/products/rc1206jr-070rl/yageo?region=nac

## Sheet 框图.SchDoc
size A3; SheetNumber: 8; SheetTotal: 8
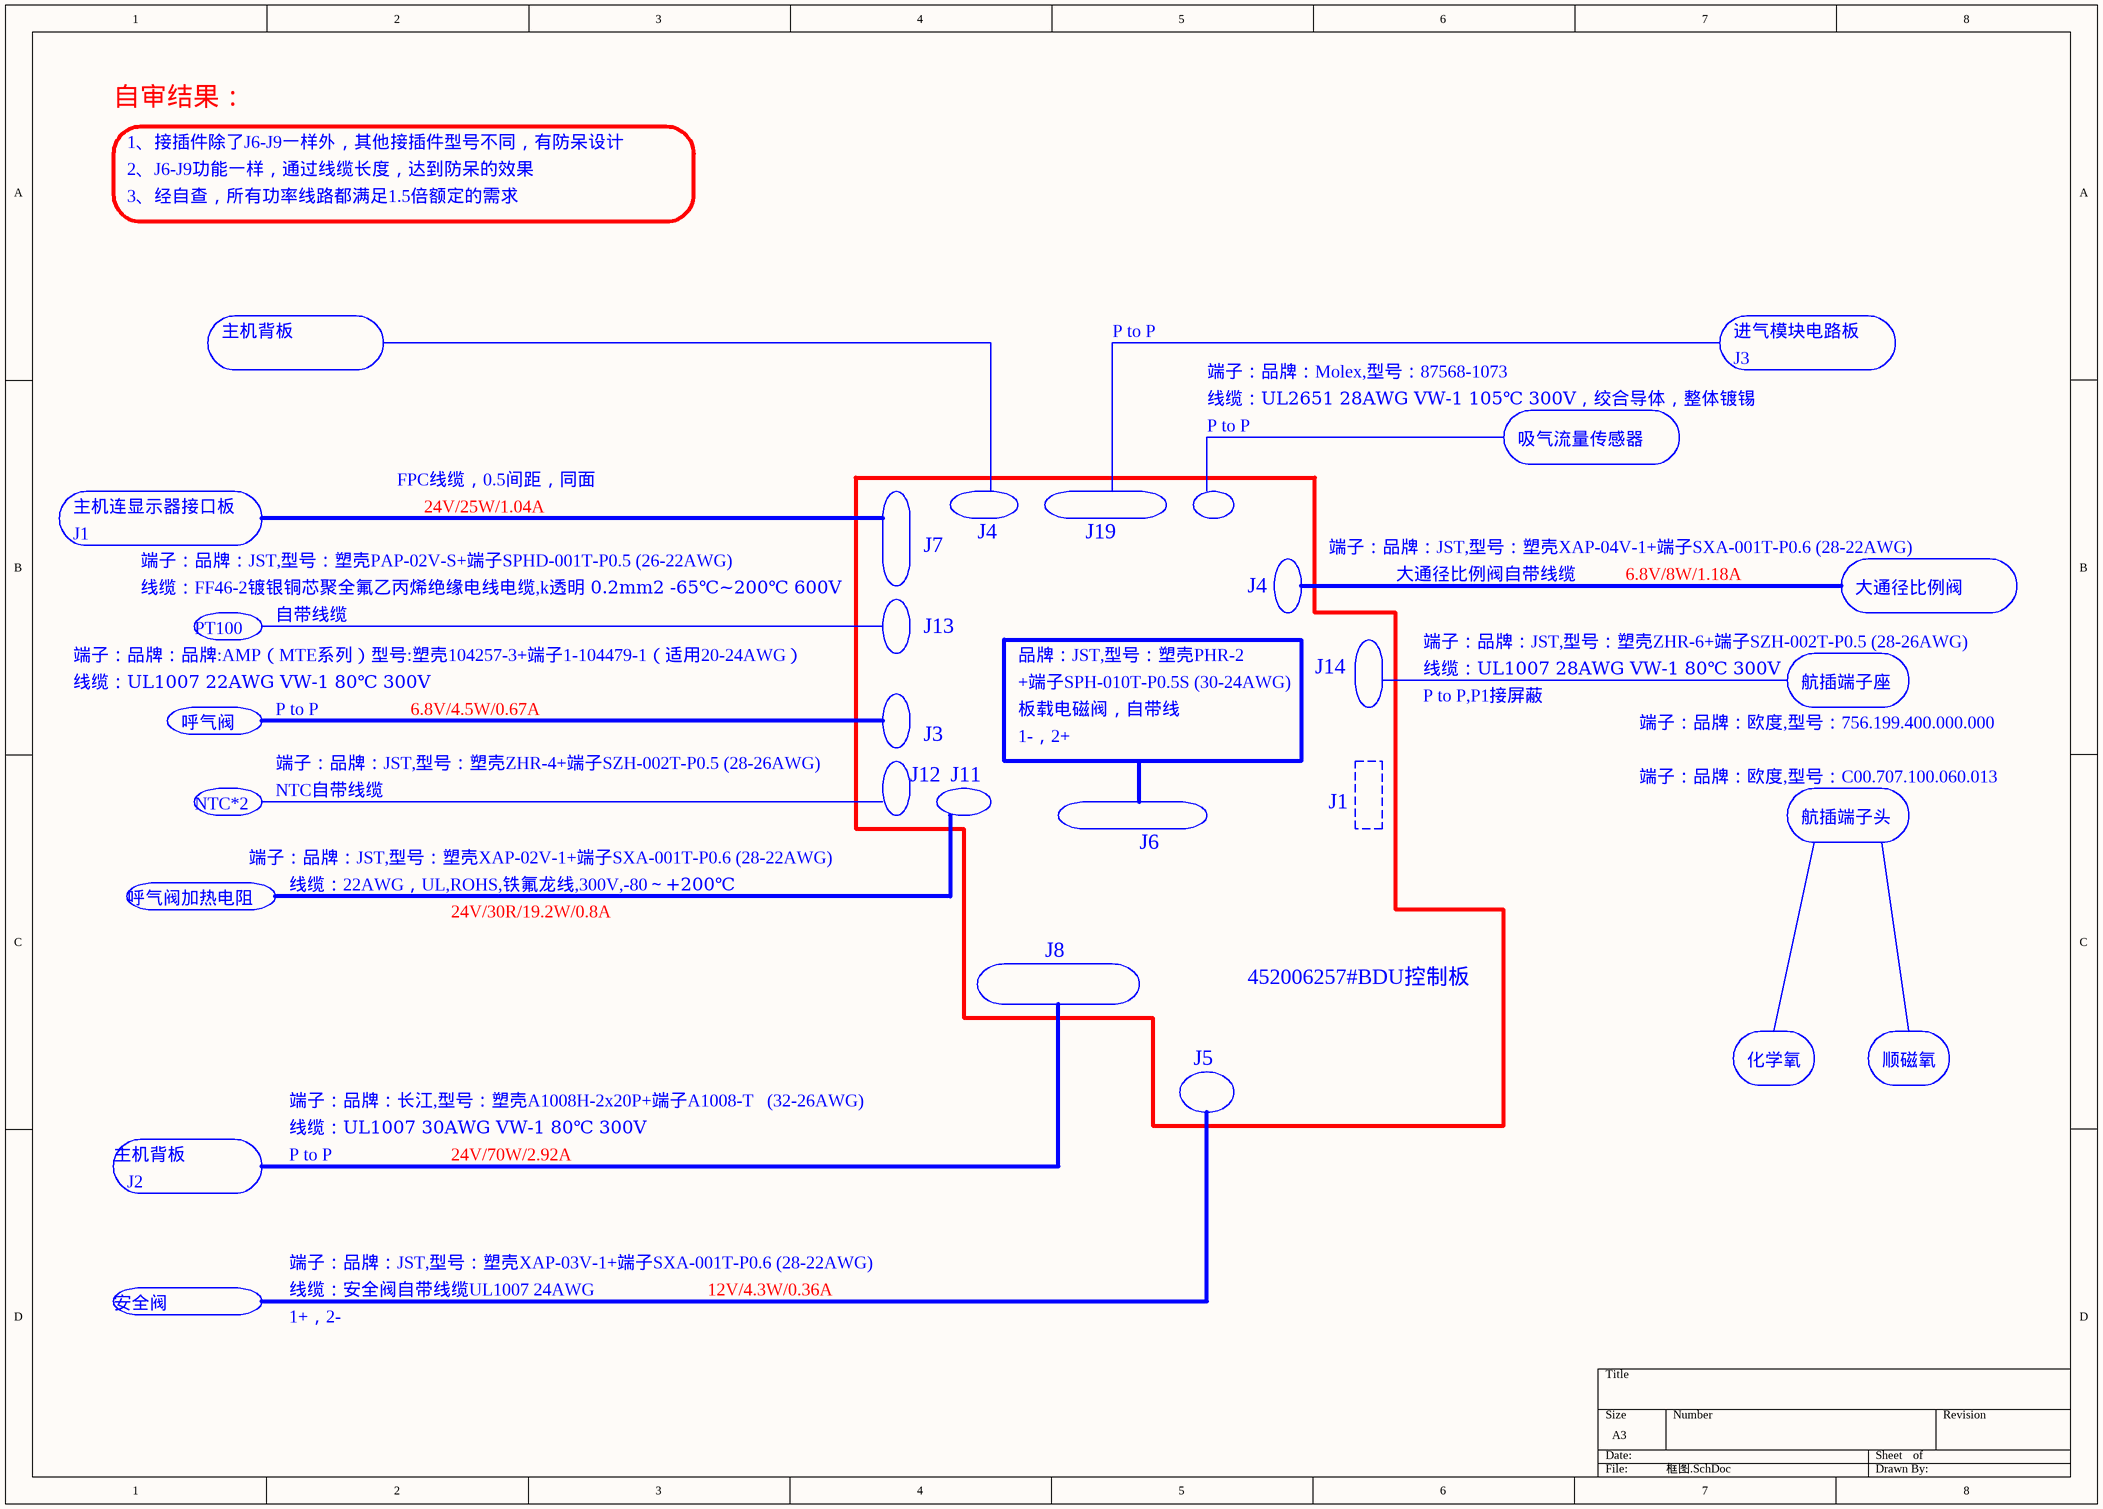
[diagram p8: 框图.SchDoc]

### Notes on the sheet
- 自审结果：
- 1、接插件除了J6-J9一样外，其他接插件型号不同，有防呆设计
- 2、J6-J9功能一样，通过线缆长度，达到防呆的效果
- 3、经自查，所有功率线路都满足1.5倍额定的需求
- 主机背板
- P to P
- 端子：品牌：Molex,型号：87568-1073
- 进气模块电路板
- J3
- 线缆：UL2651 28AWG VW-1 105℃ 300V，绞合导体，整体镀锡
- 吸气流量传感器
- 主机连显示器接口板
- FPC线缆，0.5间距，同面
- 24V/25W/1.04A
- J1
- 端子：品牌：JST,型号：塑壳PAP-02V-S+端子SPHD-001T-P0.5 (26-22AWG)
- J7
- J4
- J19
- 端子：品牌：JST,型号：塑壳XAP-04V-1+端子SXA-001T-P0.6 (28-22AWG)
- 大通径比例阀自带线缆
- 6.8V/8W/1.18A
- 线缆：FF46-2镀银铜芯聚全氟乙丙烯绝缘电线电缆,k透明 0.2mm2 -65℃~200℃ 600V
- PT100
- 自带线缆
- J13
- 端子：品牌：JST,型号：塑壳ZHR-6+端子SZH-002T-P0.5 (28-26AWG)
- 大通径比例阀
- 端子：品牌：品牌:AMP（MTE系列）型号:塑壳104257-3+端子1-104479-1（适用20-24AWG）
- 线缆：UL1007 22AWG VW-1 80℃ 300V
- 6.8V/4.5W/0.67A
- 品牌：JST,型号：塑壳PHR-2
- +端子SPH-010T-P0.5S (30-24AWG)
- 板载电磁阀，自带线
- J14
- 线缆：UL1007 28AWG VW-1 80℃ 300V
- P to P,P1接屏蔽
- 航插端子座
- 呼气阀
- 端子：品牌：JST,型号：塑壳ZHR-4+端子SZH-002T-P0.5 (28-26AWG)
- J12
- J11
- 1-，2+
- 端子：品牌：欧度,型号：756.199.400.000.000
- 端子：品牌：欧度,型号：C00.707.100.060.013
- NTC*2
- NTC自带线缆
- J6
- 航插端子头
- 呼气阀加热电阻
- 端子：品牌：JST,型号：塑壳XAP-02V-1+端子SXA-001T-P0.6 (28-22AWG)
- 线缆：22AWG，UL,ROHS,铁氟龙线,300V,-80～+200℃
- 24V/30R/19.2W/0.8A
- J8
- 452006257#BDU控制板
- 端子：品牌：长江,型号：塑壳A1008H-2x20P+端子A1008-T   (32-26AWG)
- J5
- 化学氧
- 顺磁氧
- J2
- 线缆：UL1007 30AWG VW-1 80℃ 300V
- 24V/70W/2.92A
- 安全阀
- 端子：品牌：JST,型号：塑壳XAP-03V-1+端子SXA-001T-P0.6 (28-22AWG)
- 线缆：安全阀自带线缆UL1007 24AWG
- 1+，2-
- 12V/4.3W/0.36A

## Sheet LED.SchDoc
size A4; SheetNumber: 4; SheetTotal: 10
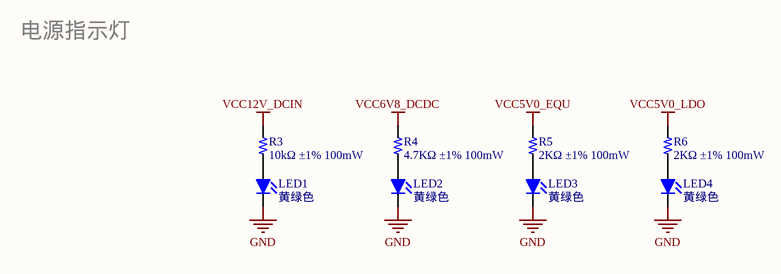
[diagram p9: LED.SchDoc]

### Parts
LED1  黄绿色  [LED-0805]
LED2  黄绿色  [LED-0805]
LED3  黄绿色  [LED-0805]
LED4  黄绿色  [LED-0805]
R3  10kΩ ±1% 100mW  [R-0603]
R4  4.7KΩ ±1% 100mW  [R-0603]
R5  2KΩ ±1% 100mW  [R-0603]
R6  2KΩ ±1% 100mW  [R-0603]

### Nets
GND: LED1.K LED2.K LED3.K LED4.K
VCC5V0_EQU: R5.2(BOT)
VCC5V0_LDO: R6.2(BOT)
VCC6V8_DCDC: R4.2(BOT)
VCC12V_DCIN: R3.2(BOT)
NetLED1_A: LED1.A R3.1(TOP)
NetLED2_A: LED2.A R4.1(TOP)
NetLED3_A: LED3.A R5.1(TOP)
NetLED4_A: LED4.A R6.1(TOP)

### Notes on the sheet
- 电源指示灯

### Library data of the parts
LED1-LED4 = LED-0805
R3-R6 = 10K_1: as R70 on sheet PressSensor2

## Nets that join several sheets
GND: OxygenSensor (7 pins), PressSensor1 (24 pins), PressSensor2 (17 pins), TSI-840523 (12 pins), IO (39 pins), Power&Vref (30 pins), Others (C44.1 R56.1), LED (LED1.K LED2.K LED3.K LED4.K)
PGND: IO (J4.27), Others (C44.2 PE1.1 R56.2)
VCC5V0_EQU: OxygenSensor (R9.2 R16.2), PressSensor1 (6 pins), PressSensor2 (R58.2 R60.1 R65.2 R67.1), TSI-840523 (R18.2 R25.2), IO (8 pins), LED (R5.2)
VCC5V0_LDO: OxygenSensor (R8.2 R15.2), PressSensor1 (R31.2 R38.2 R45.2), PressSensor2 (R57.2 R64.2), TSI-840523 (R17.2 R24.2), Power&Vref (9 pins), LED (R6.2)
VCC5V0_SYS: PressSensor1 (R33.1 R40.1 R47.1), PressSensor2 (R59.1 R66.1), IO (R52.2 R54.2), Power&Vref (S1.2)
VCC6V8_DCDC: IO (J1.2 J1.17), Power&Vref (11 pins), LED (R4.2)
VCC12V_DCIN: IO (J5.1 J5.2 T7.1 TVS1.1), Power&Vref (C2.1 C3.2 C4.2 U1.7), LED (R3.2)
DRIVE_PRESS_FILTERED: PressSensor1 (C31.2 R36.1 T17.1), IO (J4.8)
ENV_PRESS_FILTERED: PressSensor2 (C55.2 R69.1 T25.1), IO (J4.2)
EXH_FLOW_FILTERED: PressSensor2 (C49.2 R62.1 T23.1), IO (J4.12)
EXH_PRESS_FILTERED: PressSensor1 (C41.2 R50.1 T21.1), IO (J4.10)
Flow_TSI: TSI-840523 (R19.1 R21.1 T10.1), IO (J2.1)
Flow_TSI_FILTERED: TSI-840523 (C23.1 R20.2 T12.1), IO (J4.18)
INH_PRESS_FILTERED: PressSensor1 (C36.2 R43.1 T19.1), IO (J4.6)
O2_Analog: OxygenSensor (C18.2 D9.1 R10.1 R11.1), IO (J3.2)
O2_Concentration_FILTERED: OxygenSensor (C19.2 R14.1 T9.1), IO (J4.4)
Temperature_TSI: TSI-840523 (R26.1 R28.1 T13.1), IO (J2.3)
Temperature_TSI_FILTERED: TSI-840523 (C26.2 R27.1 T15.1), IO (J4.16)